# EAGLE design courtyard_power (EAGLE 6.6.0)
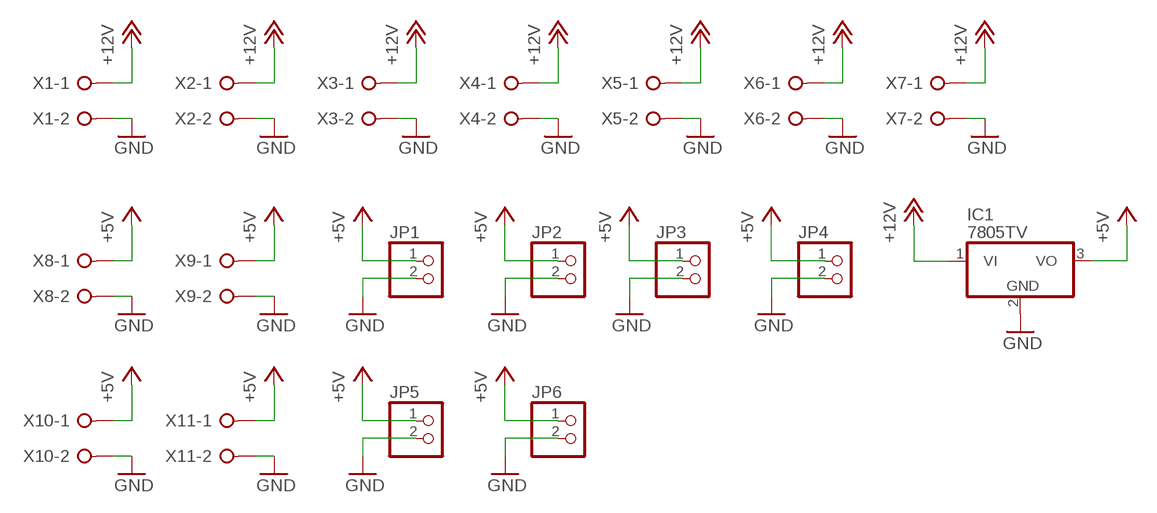
[diagram p0: schematic, sheet 1]

## Parts
IC1  7805TV  [TO220V]
JP1  PINHD-1X2  [1X02]
JP2  PINHD-1X2  [1X02]
JP3  PINHD-1X2  [1X02]
JP4  PINHD-1X2  [1X02]
JP5  PINHD-1X2  [1X02]
JP6  PINHD-1X2  [1X02]
X1  W237-02P  [W237-132]
X2  W237-02P  [W237-132]
X3  W237-02P  [W237-132]
X4  W237-02P  [W237-132]
X5  W237-02P  [W237-132]
X6  W237-02P  [W237-132]
X7  W237-02P  [W237-132]
X8  W237-02P  [W237-132]
X9  W237-02P  [W237-132]
X10  W237-02P  [W237-132]
X11  W237-02P  [W237-132]

## Nets
+5V: IC1.3(VO) JP1.1 JP2.1 JP3.1 JP4.1 JP5.1 JP6.1 X8.1 X9.1 X10.1 X11.1
+12V: IC1.1(VI) X1.1 X2.1 X3.1 X4.1 X5.1 X6.1 X7.1
GND: IC1.2(GND) JP1.2 JP2.2 JP3.2 JP4.2 JP5.2 JP6.2 X1.2 X2.2 X3.2 X4.2 X5.2 X6.2 X7.2 X8.2 X9.2 X10.2 X11.2

## Library data of the parts
IC1 = linear:78*: Positive VOLTAGE REGULATOR Source: http://cache.national.com/ds/LM/LM78L05.pdf http://www.fairchildsemi.com/ds/LM/LM7805.pdf
JP1-JP6 = pinhead:PINHD-1X2: PIN HEADER
X1-X11 = con-wago-508:W237-02P: WAGO SREW CLAMP; OC_FARNELL: unknown; OC_NEWARK: unknown

## Board
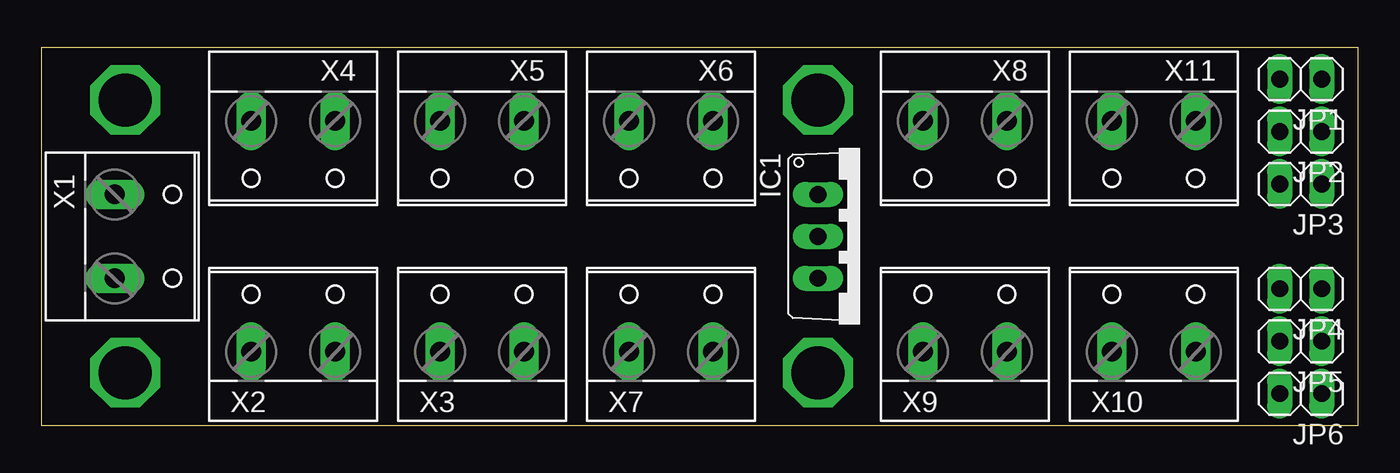
[diagram p1: board, top side]
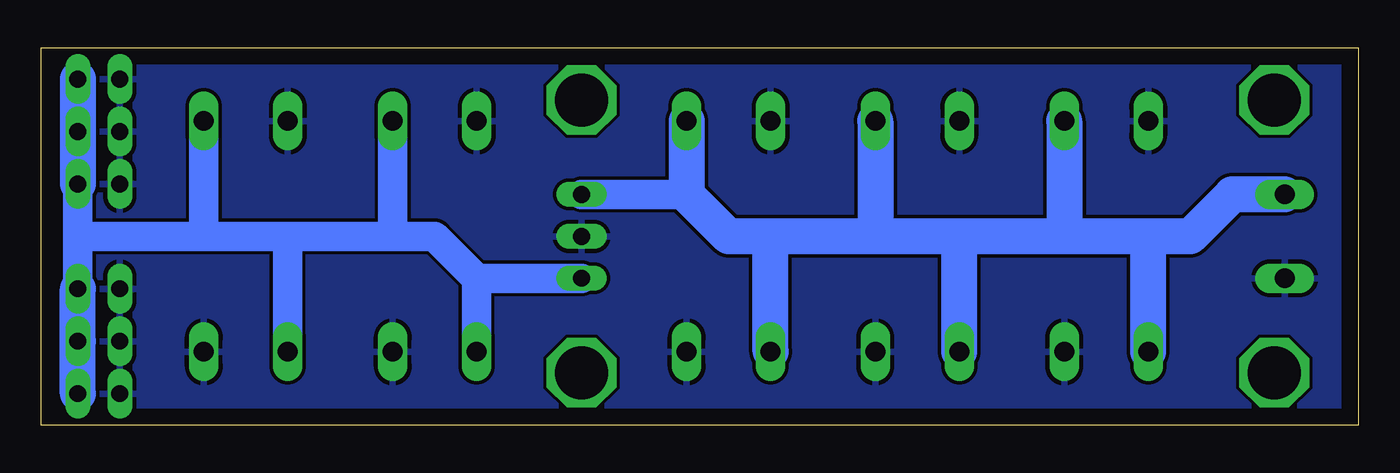
[diagram p2: board, bottom side, seen from below]

Size 79.68 x 22.85 mm. Coordinates in mm from the lower left corner, seen from the top.
Outline: 0,0 79.68,0 79.68,22.85 0,22.85 0,0
Copper layers (1*16): Top 0.035mm / dielectric 1.5mm / Bottom 0.035mm
Design rules "default": minimum track width 10mil, minimum drill 24mil, track to track 8mil, track to pad 8mil, pad to pad 8mil, via to via 8mil, smd to smd 8mil, copper to edge 40mil, drill to drill 8mil, minimum pad ring 10mil, minimum via ring 8mil, stop-mask expansion 4mil, vias tented up to drill 0mil, thermal gap 10mil

### Footprints (pad centres in the part's own frame; a part is rotated, then mirrored left to right if it is on the bottom)
TO220V = drill 1.016 long: 1 -2.54,-2.54; 2 0,-2.54; 3 2.54,-2.54
1X02 = drill 1.016 long: 1 -1.27,0; 2 1.27,0
W237-132 = drill 1.194 long: 1 -2.54,-0.635; 2 2.54,-0.635

### Placement (x,y rotation side)
IC1  49.53,11.43 270 top
JP1  76.2,20.95 180 top
JP2  76.2,17.78 180 top
JP3  76.2,14.61 180 top
JP4  76.2,8.26 180 top
JP5  76.2,5.08 180 top
JP6  76.2,1.91 180 top
X1  5.08,11.43 270 top
X2  15.24,5.08 0 top
X3  26.67,5.08 0 top
X4  15.24,17.78 180 top
X5  26.67,17.78 180 top
X6  38.1,17.78 180 top
X7  38.1,5.08 0 top
X8  55.88,17.78 180 top
X9  55.88,5.08 0 top
X10  67.31,5.08 0 top
X11  67.31,17.78 180 top

### Tracks (layer width: path | path; a pad name or v marks a point on that pad's centre or on a via)
+5V
  Bottom 1.778: IC1.3 53.34,8.89 | 58.42,11.43 55.88,11.43 53.34,8.89 | 58.42,11.43 64.77,11.43 | 64.77,11.43 69.85,11.43 | 69.85,11.43 77.47,11.43 | 77.47,11.43 JP4.1 | JP3.1 77.47,11.43 | X8.1 58.42,11.43 | X10.1 64.77,11.43 | X11.1 69.85,11.43 | X9.1 53.34,8.89
  Bottom 2.184: JP1.1 JP2.1 JP3.1 | JP6.1 JP5.1 JP4.1
+12V
  Bottom 1.778: 40.64,13.97 IC1.1
  Bottom 2.184: X1.1 7.62,13.97 10.16,11.43 12.7,11.43 | 12.7,11.43 17.78,11.43 | 17.78,11.43 24.13,11.43 | 24.13,11.43 29.21,11.43 | 29.21,11.43 35.56,11.43 | 35.56,11.43 38.1,11.43 40.64,13.97 X6.1 | X5.1 29.21,11.43 | X4.1 17.78,11.43 | X2.1 12.7,11.43 | X3.1 24.13,11.43 | X7.1 35.56,11.43
GND
  pour Bottom: 0,22.86 79.38,22.86 79.38,0 0,0
N$1  (via drill 3.2)
  other vias: 46.99,19.68
N$2  (via drill 3.2)
  other vias: 5.08,3.17
N$3  (via drill 3.2)
  other vias: 5.08,19.68
N$4  (via drill 3.2)
  other vias: 46.99,3.17